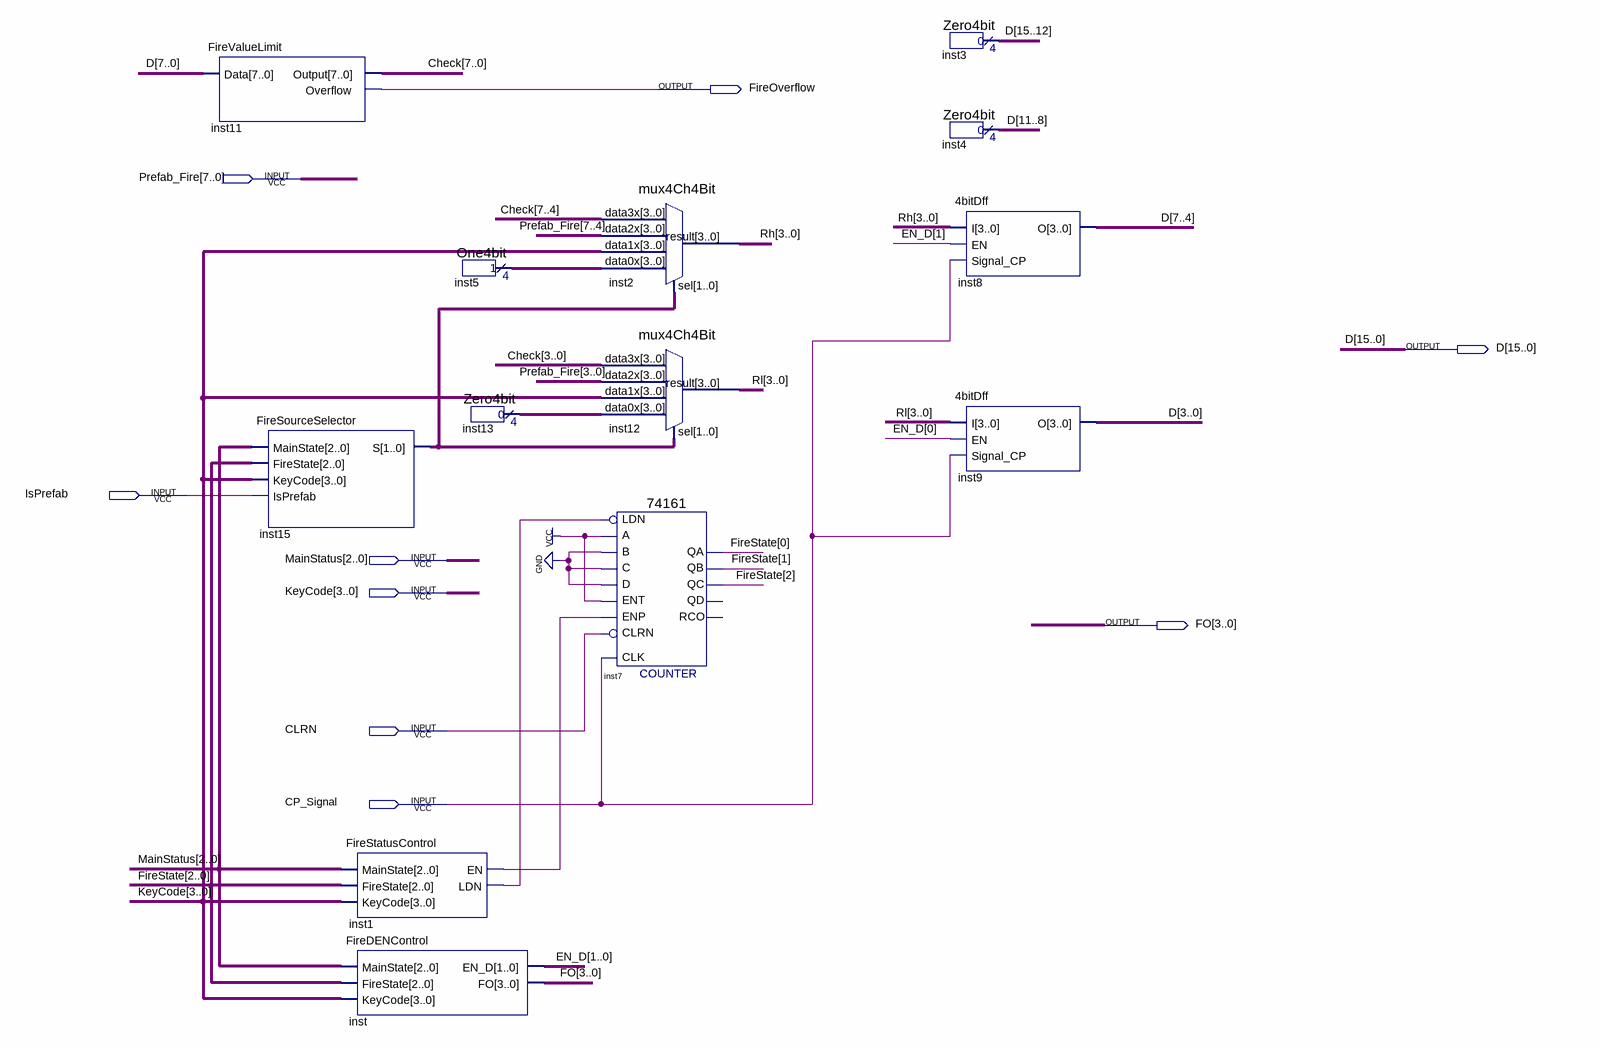
[diagram p0: schematic sheet]
// Quartus schematic FireStatus.bdf as structural Verilog: 13 symbols, 9 pins
module FireStatus (
  input  [7:0] Prefab_Fire,
  input  IsPrefab,
  input  [2:0] MainStatus,
  input  [3:0] KeyCode,
  input  CLRN,
  input  CP_Signal,
  output FireOverflow,
  output [15:0] D,
  output [3:0] FO
);

  wire inst1_en, inst1_ldn;
  wire [1:0] EN_D, inst15_s;
  wire [2:0] FireState;
  wire [3:0] inst5_result, inst13_result, Rh, Rl;
  wire [7:0] Check;

  FireValueLimit inst11 (.Data(D[7:0]), .Output(Check), .Overflow(FireOverflow));
  FireSourceSelector inst15 (
    .MainState(MainStatus), .FireState(FireState), .KeyCode(KeyCode), .IsPrefab(IsPrefab), .S(inst15_s));
  FireStatusControl inst1 (
    .MainState(MainStatus), .FireState(FireState), .KeyCode(KeyCode), .EN(inst1_en), .LDN(inst1_ldn));
  FireDENControl inst (.MainState(MainStatus), .FireState(FireState), .KeyCode(KeyCode), .EN_D(EN_D), .FO(FO));
  One4bit inst5 (.result(inst5_result));
  Zero4bit inst13 (.result(inst13_result));
  mux4Ch4Bit inst2 (
    .data3x(Check[7:4]), .data2x(Prefab_Fire[7:4]), .data1x(KeyCode), .data0x(inst5_result), .sel(inst15_s),
    .result(Rh));
  mux4Ch4Bit inst12 (
    .data3x(Check[3:0]), .data2x(Prefab_Fire[3:0]), .data1x(KeyCode), .data0x(inst13_result), .sel(inst15_s),
    .result(Rl));
  \74161  inst7 (
    .CLRN(CLRN), .CLK(CP_Signal), .ENP(inst1_en), .LDN(inst1_ldn), .A(1'b1), .D(1'b0), .ENT(1'b1), .B(1'b0),
    .C(1'b0), .QC(FireState[2]), .QB(FireState[1]), .QA(FireState[0]));  // open: QD, RCO
  Zero4bit inst3 (.result(D[15:12]));
  Zero4bit inst4 (.result(D[11:8]));
  \4bitDff  inst8 (.I(Rh), .EN(EN_D[1]), .Signal_CP(CP_Signal), .O(D[7:4]));
  \4bitDff  inst9 (.I(Rl), .EN(EN_D[0]), .Signal_CP(CP_Signal), .O(D[3:0]));
endmodule
